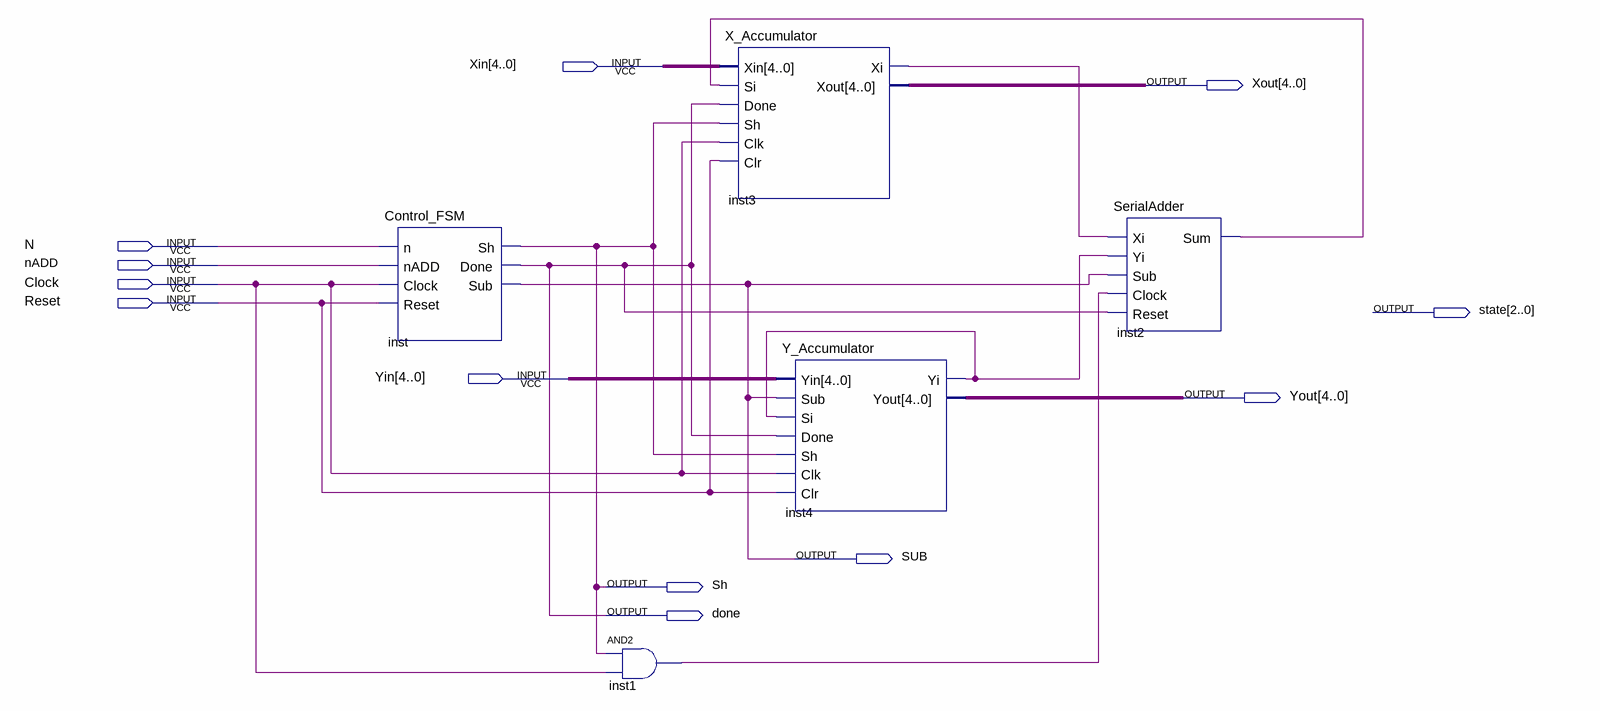
[diagram p0: schematic sheet]
// Quartus schematic BSAS5B.bdf as structural Verilog: 5 symbols, 12 pins
module BSAS5B (
  input  [4:0] Xin,
  input  N,
  input  nADD,
  input  Clock,
  input  Reset,
  input  [4:0] Yin,
  output [4:0] Xout,
  output [2:0] state,
  output [4:0] Yout,
  output SUB,
  output Sh,
  output done
);

  wire inst1_out, inst2_sum, inst3_xi, inst4_yi;

  Control_FSM inst (.n(N), .nADD(nADD), .Clock(Clock), .Reset(Reset), .Sh(Sh), .Done(done), .Sub(SUB));
  and inst1 (inst1_out, Sh, Clock);
  X_Accumulator inst3 (
    .Xin(Xin), .Si(inst2_sum), .Done(done), .Sh(Sh), .Clk(Clock), .Clr(Reset), .Xi(inst3_xi), .Xout(Xout));
  Y_Accumulator inst4 (
    .Yin(Yin), .Sub(SUB), .Si(inst4_yi), .Done(done), .Sh(Sh), .Clk(Clock), .Clr(Reset), .Yi(inst4_yi),
    .Yout(Yout));
  SerialAdder inst2 (.Xi(inst3_xi), .Yi(inst4_yi), .Sub(SUB), .Clock(inst1_out), .Reset(done), .Sum(inst2_sum));
endmodule
